# EasyEDA schematic SCH_AGV_genzero_10_ir_array_2024-06-24.json
TITLE: Sheet_1; REV: 1.0; Date: 2024-01-31; Sheet: 1/1; Drawn By: Araf Israk; Company: Your Company
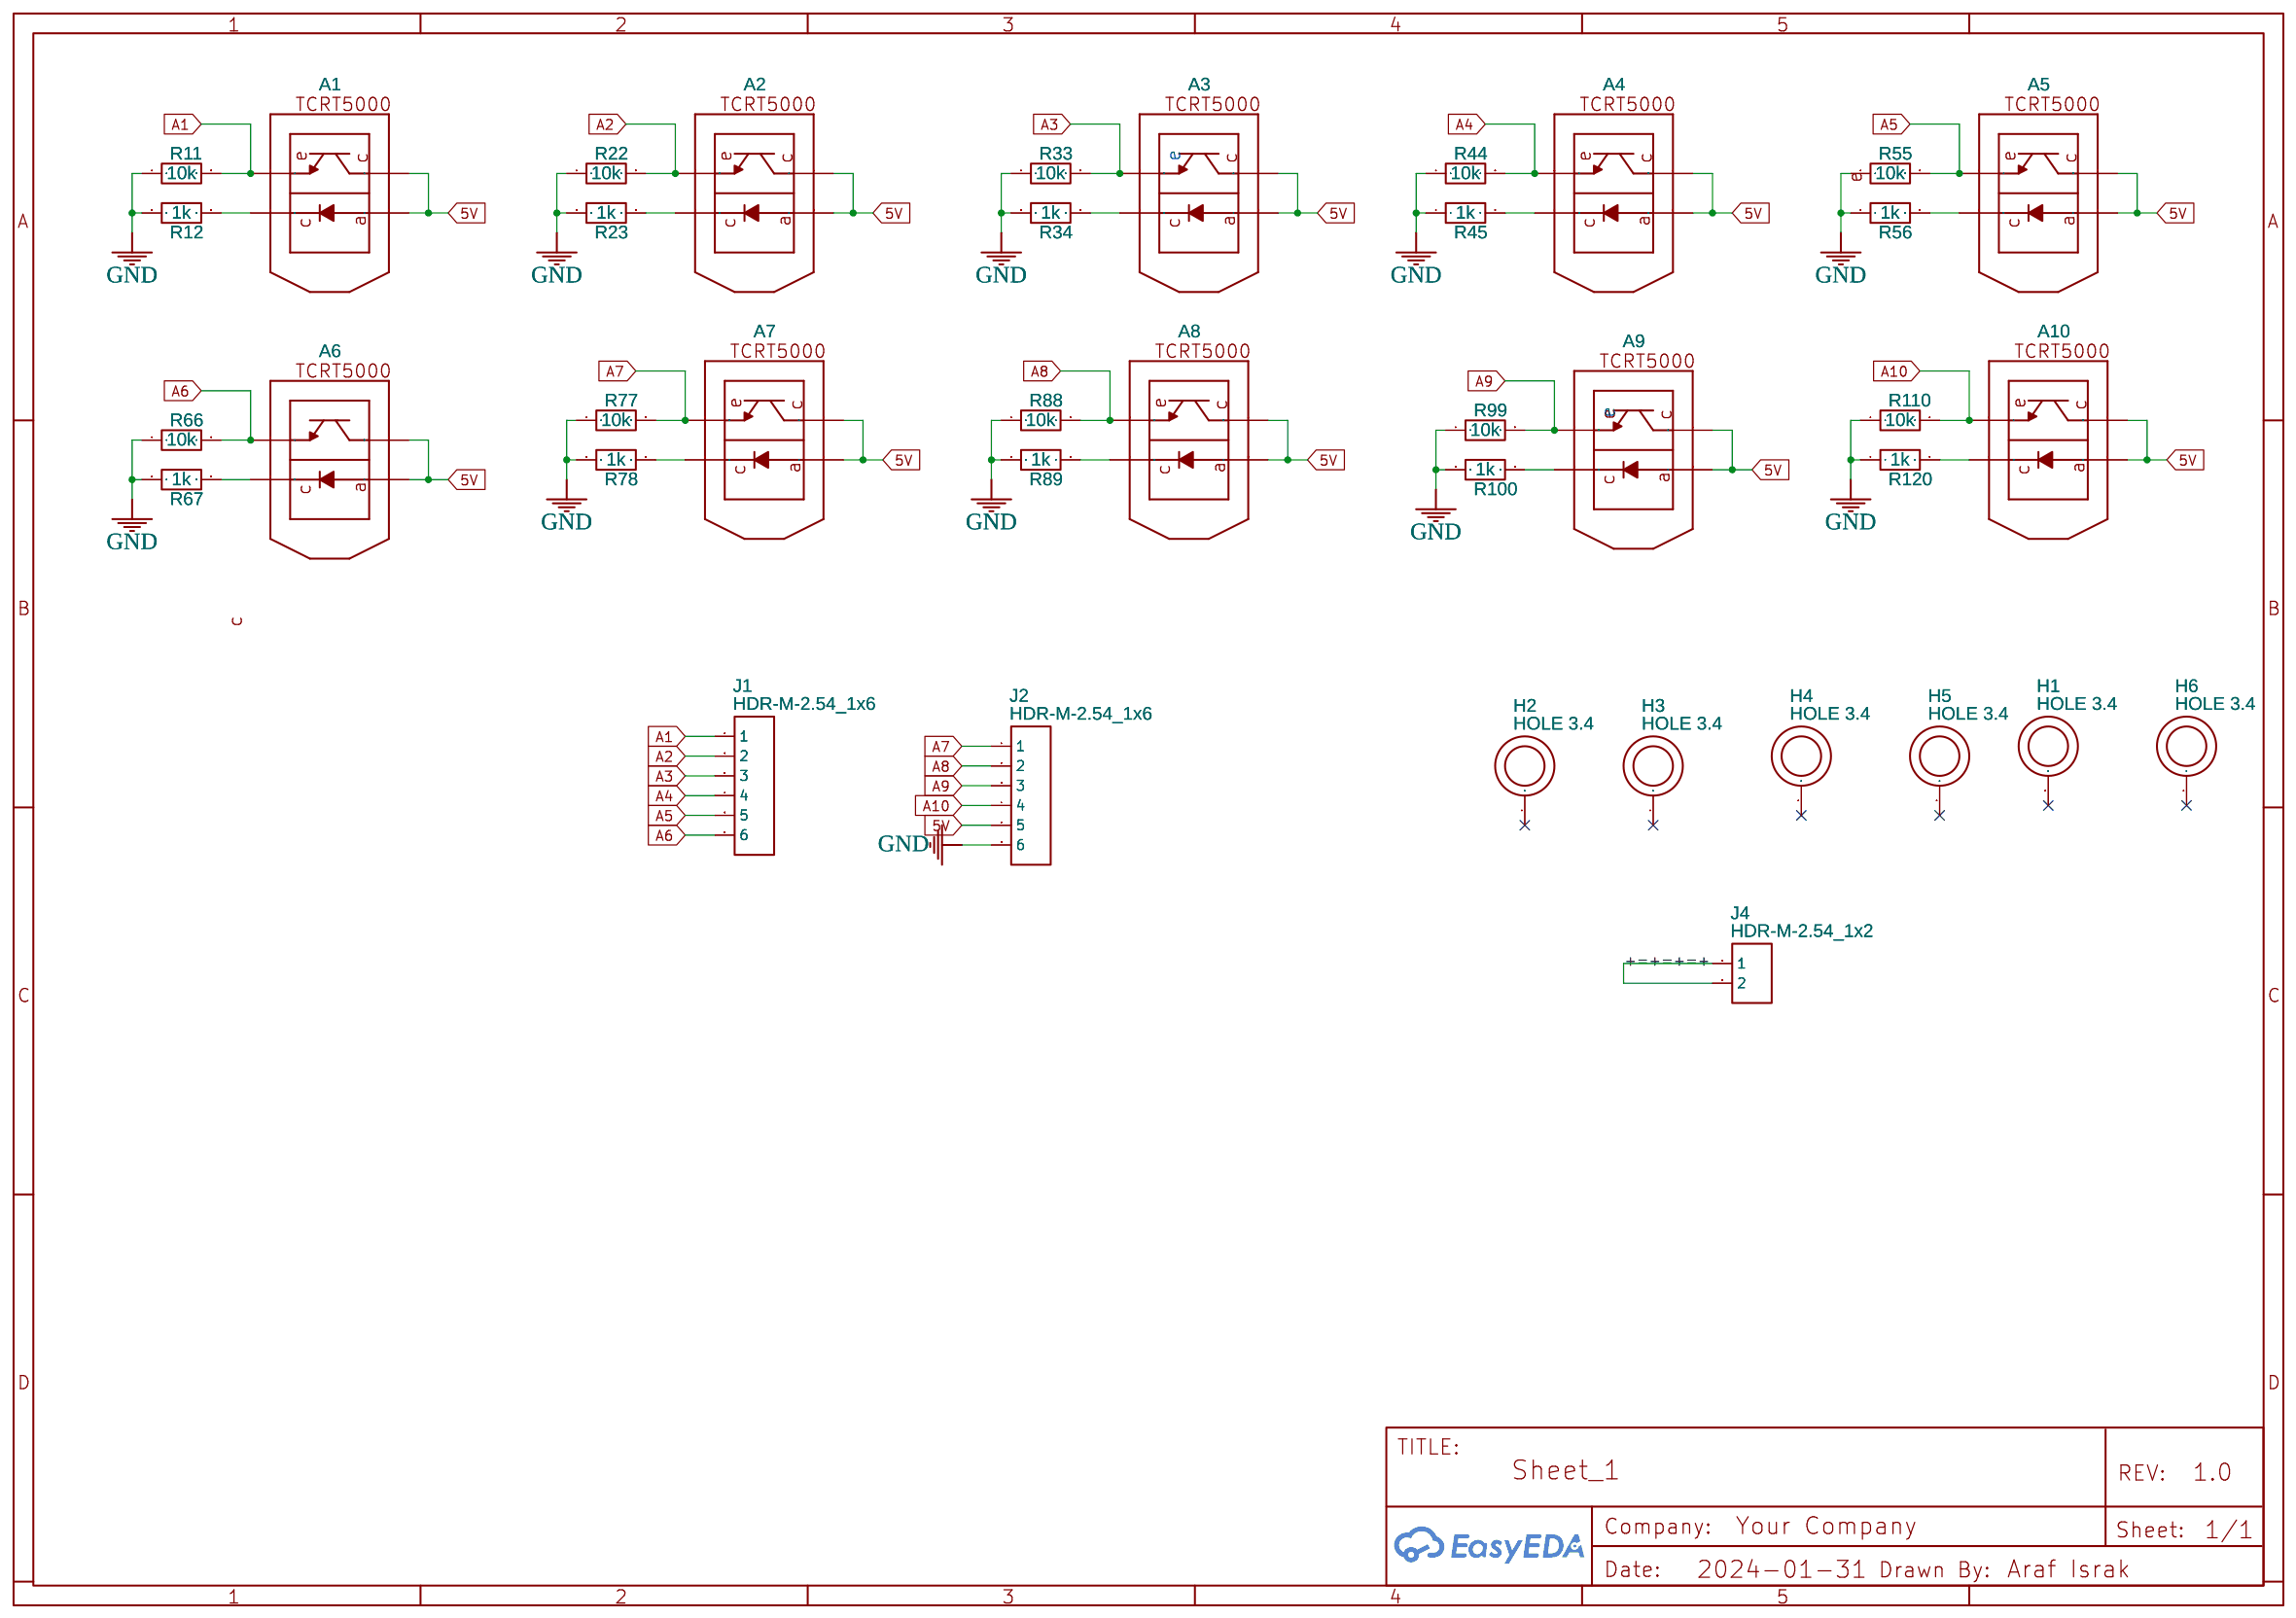
[diagram p0: schematic sheet]

## Parts
A1  TCRT5000L  [OPTO-TH_TCRT5000L]
A2  TCRT5000L  [OPTO-TH_TCRT5000L]
A3  TCRT5000L  [OPTO-TH_TCRT5000L]
A4  TCRT5000L  [OPTO-TH_TCRT5000L]
A5  TCRT5000L  [OPTO-TH_TCRT5000L]
A6  TCRT5000L  [OPTO-TH_TCRT5000L]
A7  TCRT5000L  [OPTO-TH_TCRT5000L]
A8  TCRT5000L  [OPTO-TH_TCRT5000L]
A9  TCRT5000L  [OPTO-TH_TCRT5000L]
A10  TCRT5000L  [OPTO-TH_TCRT5000L]
H1  HOLE 3.4  [HOLEHOLE]
H2  HOLE 3.4  [HOLEHOLE]
H3  HOLE 3.4  [HOLEHOLE]
H4  HOLE 3.4  [HOLEHOLE]
H5  HOLE 3.4  [HOLEHOLE]
H6  HOLE 3.4  [HOLEHOLE]
J1  HDR-M-2.54_1x6  [HDR-M-2.54_1X6]
J2  HDR-M-2.54_1x6  [HDR-M-2.54_1X6]
J4  HDR-M-2.54_1x2  [HDR-M-2.54_1X2]
R11  10k  [RES-TH_BD1.8-L3.2-P7.20-D0.4]
R12  1k  [RES-TH_BD1.8-L3.2-P7.20-D0.4]
R22  10k  [RES-TH_BD1.8-L3.2-P7.20-D0.4]
R23  1k  [RES-TH_BD1.8-L3.2-P7.20-D0.4]
R33  10k  [RES-TH_BD1.8-L3.2-P7.20-D0.4]
R34  1k  [RES-TH_BD1.8-L3.2-P7.20-D0.4]
R44  10k  [RES-TH_BD1.8-L3.2-P7.20-D0.4]
R45  1k  [RES-TH_BD1.8-L3.2-P7.20-D0.4]
R55  10k  [RES-TH_BD1.8-L3.2-P7.20-D0.4]
R56  1k  [RES-TH_BD1.8-L3.2-P7.20-D0.4]
R66  10k  [RES-TH_BD1.8-L3.2-P7.20-D0.4]
R67  1k  [RES-TH_BD1.8-L3.2-P7.20-D0.4]
R77  10k  [RES-TH_BD1.8-L3.2-P7.20-D0.4]
R78  1k  [RES-TH_BD1.8-L3.2-P7.20-D0.4]
R88  10k  [RES-TH_BD1.8-L3.2-P7.20-D0.4]
R89  1k  [RES-TH_BD1.8-L3.2-P7.20-D0.4]
R99  10k  [RES-TH_BD1.8-L3.2-P7.20-D0.4]
R100  1k  [RES-TH_BD1.8-L3.2-P7.20-D0.4]
R110  10k  [RES-TH_BD1.8-L3.2-P7.20-D0.4]
R120  1k  [RES-TH_BD1.8-L3.2-P7.20-D0.4]

## Library data of the parts
A1-A10 = TCRT5000L: Supplier: LCSC; Manufacturer: VISHAY(威世); Supplier Part: C24085; JLCPCB Part Class: Extended Part
H1-H6 = HOLE 3.4: Contributor: kimjonghoon2902
J1 J2 = HDR-M-2.54_1x6: Supplier Part: C190819; Supplier: LCSC; Contributor: LCEDA_Lib
J4 = HDR-M-2.54_1x2: Supplier Part: C124375; Supplier: LCSC; Contributor: LCEDA_Lib
R11 R12 R22 R23 R33 R34 R44 R45 R55 R56 R66 R67 R77 R78 R88 R89 R99 R100 R110 R120 = CF1/6W-10KΩ±5%T52: Contributor: LCSC; Supplier: LCSC; Supplier Part: C714232; Manufacturer: 华星机电; JLCPCB Part Class: Extended Part

## Nets
5V: A1.1(C) A1.3(A) A2.1(C) A2.3(A) A3.1(C) A3.3(A) A4.1(C) A4.3(A) A5.1(C) A5.3(A) A6.1(C) A6.3(A) A7.1(C) A7.3(A) A8.1(C) A8.3(A) A9.1(C) A9.3(A) A10.1(C) A10.3(A) J2.5
GND: J2.6 R11.1 R12.1 R22.1 R23.1 R33.1 R34.1 R44.1 R45.1 R55.1 R56.1 R66.1 R67.1 R77.1 R78.1 R88.1 R89.1 R99.1 R100.1 R110.1 R120.1
+=+=+=+: J4.1 J4.2
A1: A1.2(E) J1.1 R11.2
A2: A2.2(E) J1.2 R22.2
A3: A3.2(E) J1.3 R33.2
A4: A4.2(E) J1.4 R44.2
A5: A5.2(E) J1.5 R55.2
A6: A6.2(E) J1.6 R66.2
A7: A7.2(E) J2.1 R77.2
A8: A8.2(E) J2.2 R88.2
A9: A9.2(E) J2.3 R99.2
A10: A10.2(E) J2.4 R110.2
Net-(A1-4): A1.4(C) R12.2
Net-(A2-4): A2.4(C) R23.2
Net-(A3-4): A3.4(C) R34.2
Net-(A4-4): A4.4(C) R45.2
Net-(A5-4): A5.4(C) R56.2
Net-(A6-4): A6.4(C) R67.2
Net-(A7-4): A7.4(C) R78.2
Net-(A8-4): A8.4(C) R89.2
Net-(A9-4): A9.4(C) R100.2
Net-(A10-4): A10.4(C) R120.2

Not connected (* = marked no-connect by the designer): H1 1*; H2 1*; H3 1*; H4 1*; H5 1*; H6 1*

## Notes on the sheet
- e
- e
